# EAGLE design FSK (EAGLE 6.5.0)
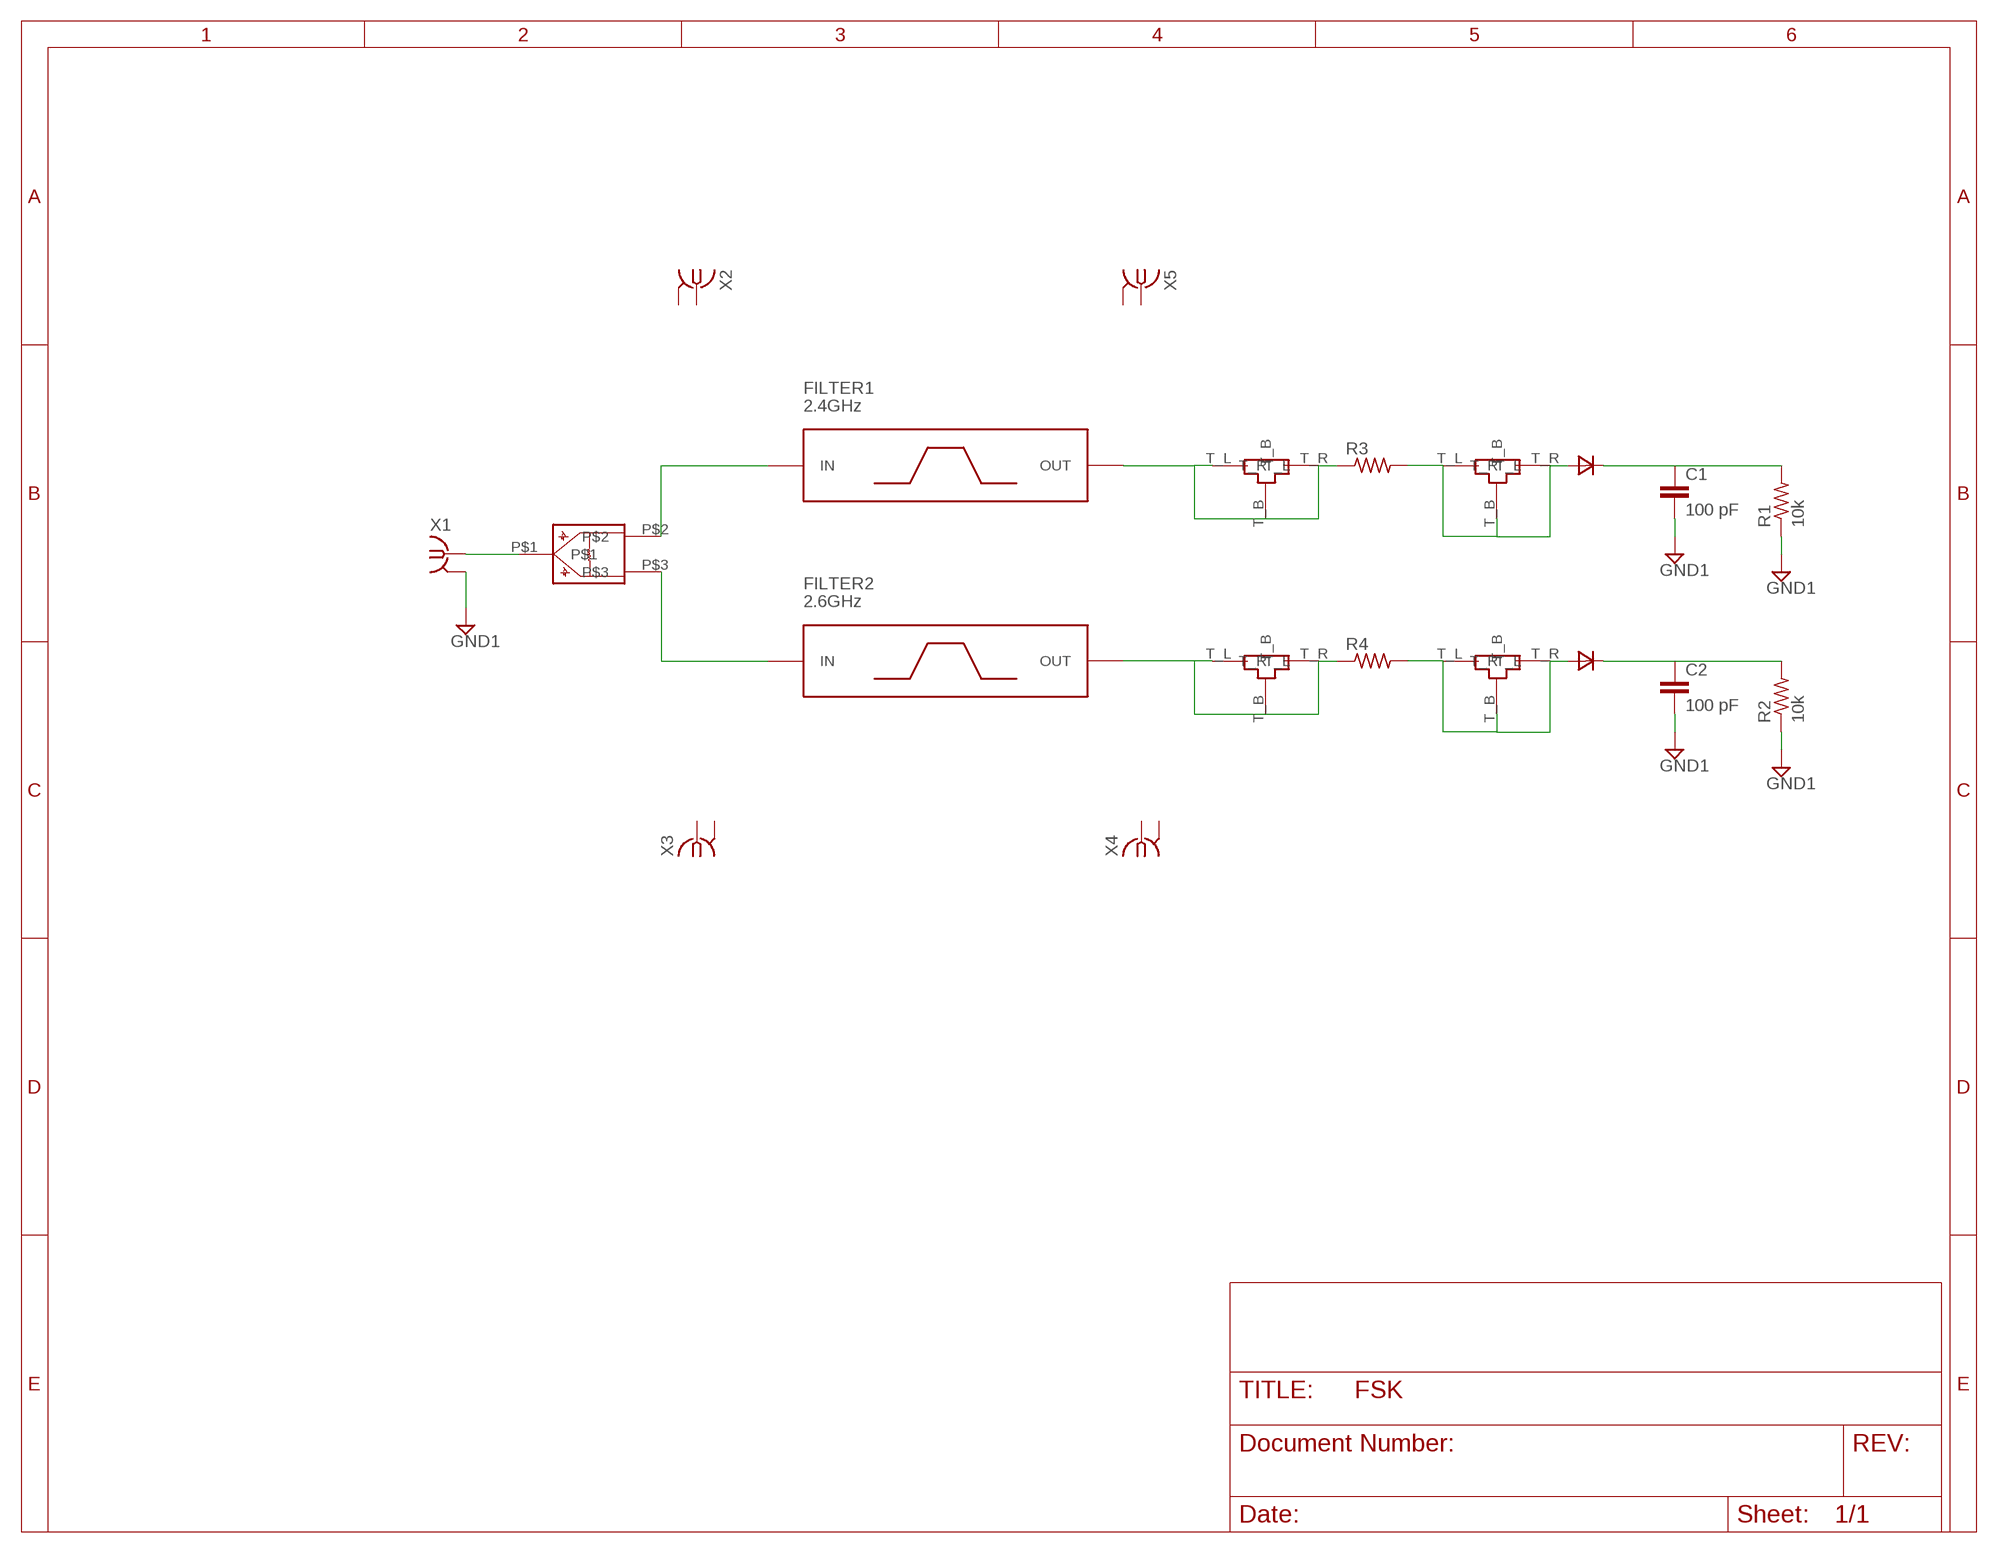
[diagram p0: schematic, sheet 1]

## Parts
2.4FIL  TEE_TL1  [TEE_TL1]
2.4TUNED  TEE_TL1  [TEE_TL1]
2.6FIL  TEE_TL1  [TEE_TL1]
2.6TUNED  TEE_TL1  [TEE_TL1]
C1  100 pF  C-EUC0603  [C0603]
C2  100 pF  C-EUC0603  [C0603]
FILTER1  2.4GHz  1IN_PIPE_CAP  [1IN_PIPE_CAP]
FILTER2  2.6GHz  1IN_PIPE_CAP  [1IN_PIPE_CAP]
R1  10k  R-US_M1206  [M1206]
R2  10k  R-US_M1206  [M1206]
R3  R-US_R0603  [R0603]
R4  R-US_R0603  [R0603]
U$1  WSPLITTER_2.5GHZ  [WSPLITTER_2.5GHZ]
U$2  HSMS-2850  [HSMS-2850]
U$3  HSMS-2850  [HSMS-2850]
X1  SMA-142-0711-821/826  [J502-ND-142-0711-821/826]
X2  SMA-142-0711-821/826  [J502-ND-142-0711-821/826]
X3  SMA-142-0711-821/826  [J502-ND-142-0711-821/826]
X4  SMA-142-0711-821/826  [J502-ND-142-0711-821/826]
X5  SMA-142-0711-821/826  [J502-ND-142-0711-821/826]

## Nets
2.4FIL: 2.4FIL.T_B 2.4FIL.T_L 2.4FIL.T_R FILTER1.OUT R3.1
2.4GHZ: FILTER1.IN U$1.P$2
2.4TUNED: 2.4TUNED.T_B 2.4TUNED.T_L 2.4TUNED.T_R R3.2 U$2.A
2.6FIL: 2.6FIL.T_B 2.6FIL.T_L 2.6FIL.T_R FILTER2.OUT R4.1
2.6GHZ: FILTER2.IN U$1.P$3
2.6TUNED: 2.6TUNED.T_B 2.6TUNED.T_L 2.6TUNED.T_R R4.2 U$3.A
GND1: C1.2 C2.2 R1.1 R2.1 X1.G@1 X1.G@2 X1.G@3 X1.G@4
N$3: C1.1 R1.2 U$2.C
N$4: C2.1 R2.2 U$3.C
N$5: U$1.P$1 X1.1
Unconnected: X2.1 X2.G@1 X2.G@2 X2.G@3 X2.G@4 X3.1 X3.G@1 X3.G@2 X3.G@3 X3.G@4 X4.1 X4.G@1 X4.G@2 X4.G@3 X4.G@4 X5.1 X5.G@1 X5.G@2 X5.G@3 X5.G@4

## Library data of the parts
2.4FIL 2.4TUNED 2.6FIL 2.6TUNED = ECE532_Parts:TEE_TL1
C1 C2 = rcl:C-EU: CAPACITOR, European symbol
FILTER1 FILTER2 = ECE532_Parts:1IN_PIPE_CAP
R1-R4 = rcl:R-US_: RESISTOR, American symbol
U$1 = ECE532_Parts:WSPLITTER_2.5GHZ
U$2 U$3 = ECE532_Parts:HSMS-2850
X1-X5 = con-coax:SMA-: SMA 50 Ohm End Launch Jack Receptacle - Round Contact Johnson Components Source: www.johnsoncomponents.com .. J502-ND.pdf; MF: JOHNSON COMPONENTS; MPN: 142-0711-821; OC_FARNELL: 1019328; OC_NEWARK: 16F3627

## Board
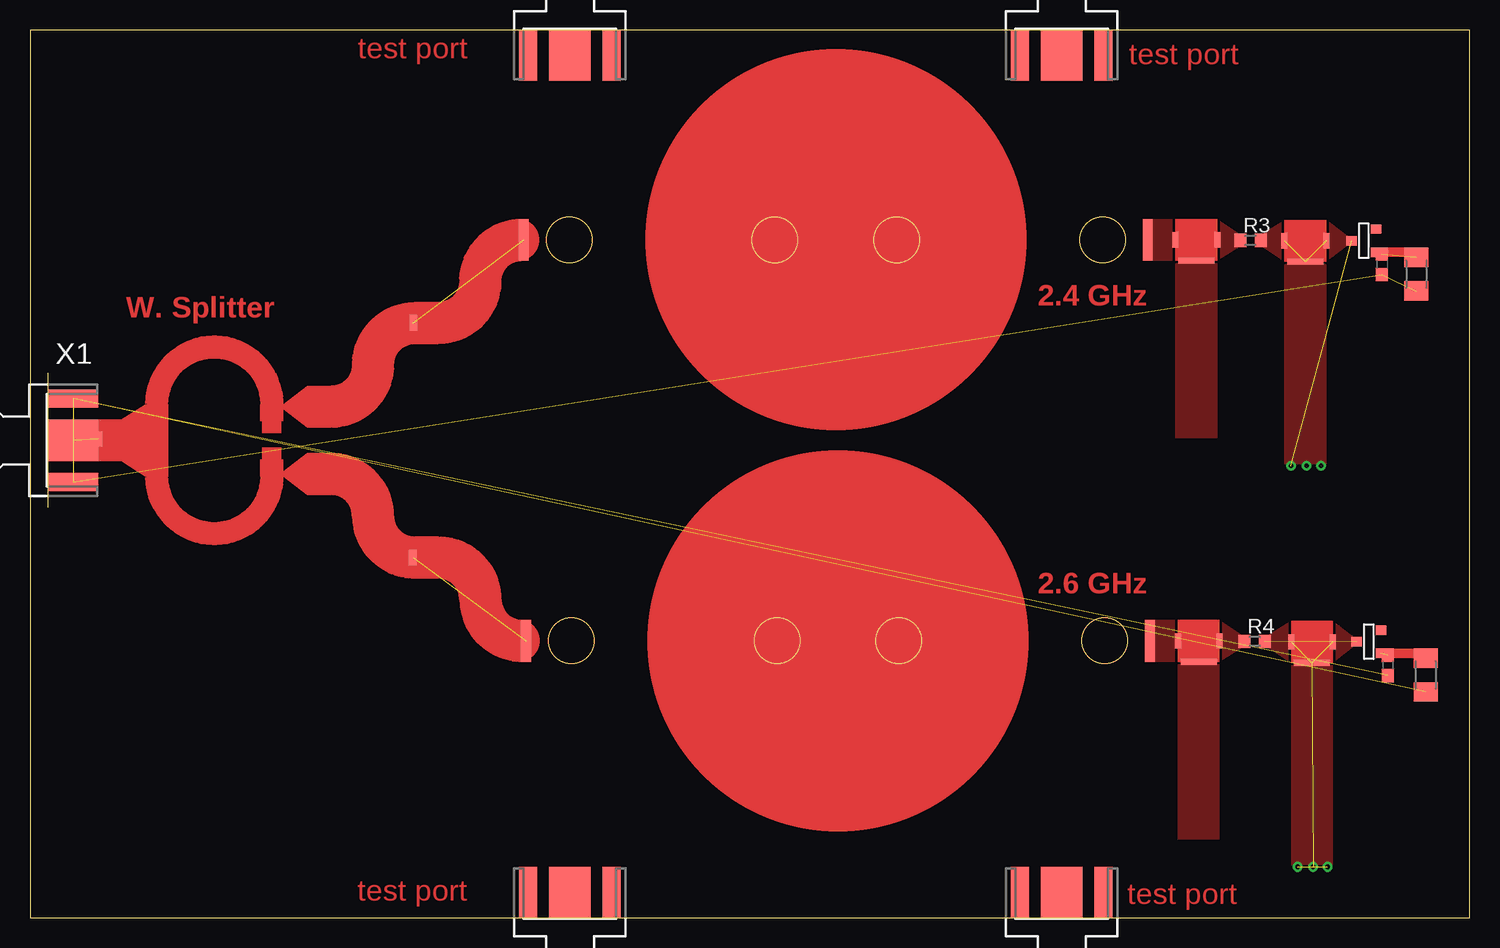
[diagram p1: board, top side]
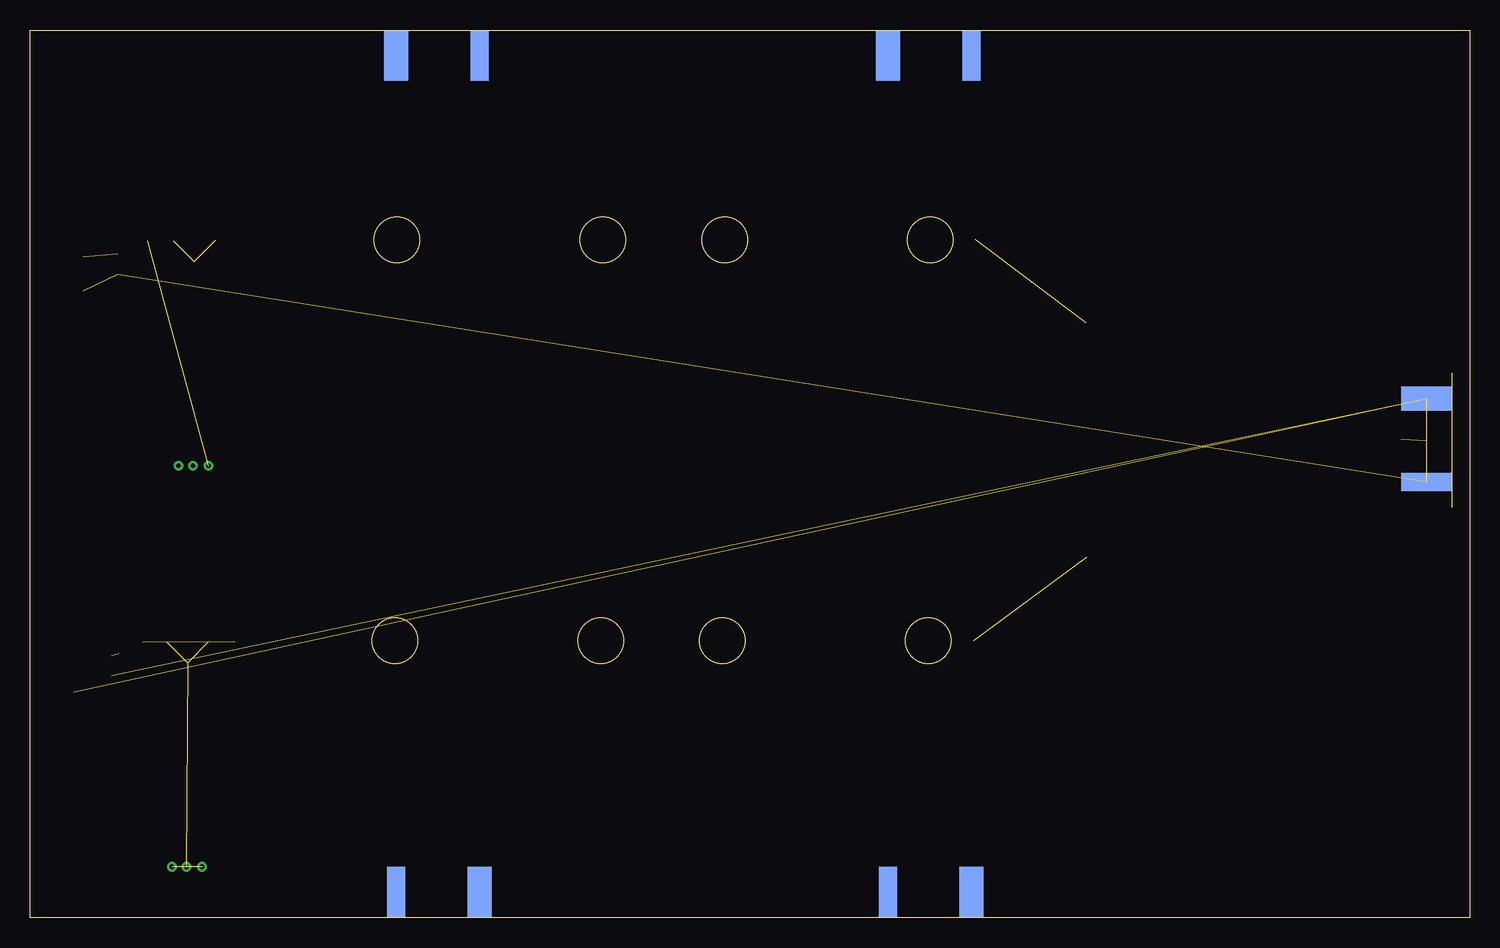
[diagram p2: board, bottom side, seen from below]

Size 120 x 74 mm. Coordinates in mm from the lower left corner, seen from the top.
Outline: 0,0 120,0 120,74 0,74 0,0
Copper layers (1*16): Top 0.035mm / dielectric 1.5mm / Bottom 0.035mm
Design rules "default": minimum track width 10mil, minimum drill 24mil, track to track 8mil, track to pad 8mil, pad to pad 8mil, via to via 8mil, smd to smd 8mil, copper to edge 40mil, drill to drill 8mil, minimum pad ring 10mil, minimum via ring 8mil, stop-mask expansion 4mil, vias tented up to drill 0mil, thermal gap 10mil

### Footprints (pad centres in the part's own frame; a part is rotated, then mirrored left to right if it is on the bottom)
TEE_TL1 = smd 3 x 0.5: T_B 0,-0.475 | smd 0.5 x 1.27: T_L -1.745,1.27; T_R 1.745,1.27
C0603 = smd 1.1 x 1: 1 -0.85,0; 2 0.85,0
1IN_PIPE_CAP = smd 0.8 x 3.49: IN -26,0; OUT 26,0
M1206 = smd 1.6 x 2: 1 -1.4,0; 2 1.4,0
R0603 = smd 1 x 1.1: 1 -0.85,0; 2 0.85,0
WSPLITTER_2.5GHZ = smd 0.635 x 1.27: P$1 -9.743,-0.194; P$2 16.528,9.479; P$3 16.499,-10.092
HSMS-2850 = smd 0.787 x 0.889: A 0.025,-1.016; C 0.991,1.016; NC -0.94,1.016
J502-ND-142-0711-821/826 = smd 4.191 x 3.49: 1 2.115,0 | smd 4.191 x 1.5: G@1 2.115,3.495; G@2 2.115,-3.495 | smd 4.191 x 2 bottom: G@3 2.115,3.495 | smd 4.191 x 1.5 bottom: G@4 2.115,-3.495

### Placement (x,y rotation side)
2.4FIL  97.23,55.23 0 top
2.4TUNED  106.33,55.15 0 top
2.6FIL  97.42,21.8 0 top
2.6TUNED  106.87,21.72 0 top
C1  112.69,54.45 270 top
C2  113.19,21.02 270 top
FILTER1  67.18,56.5 0 top
FILTER2  67.35,23.07 0 top
R1  115.56,53.65 90 top
R2  116.33,20.22 90 top
R3  101.74,56.46 0 top
R4  102.09,23.03 0 top
U$1  15.43,40.1 0 top
U$2  111.19,56.46 270 top
U$3  111.6,23.02 270 top
X1  1.48,39.79 0 top
X2  45,0 90 top
X3  45,74 270 top
X4  86,0 90 top
X5  86,74 270 top

### Tracks (layer width: path | path; a pad name or v marks a point on that pad's centre or on a via)
2.4FIL
  pour Top (no thermals): 95.48,54.76 98.97,54.76 98.97,39.96 95.48,39.96
  pour Top (no thermals): 93.5,58.25 95.5,58.25 95.5,54.76 93.5,54.76
  pour Top (no thermals): 98.97,54.76 98.97,58.25 100.97,56.9 100.97,56
2.4GHZ  (1 unrouted)
2.4TUNED  (via drill 0.4)  (3 unrouted)
  other vias: 105.12,37.66 106.42,37.66 107.62,37.66
  pour Top (no thermals): 104.58,58.16 104.58,54.67 102.58,56.02 102.58,56.92
  pour Top (no thermals): 108.06,54.68 108.06,58.17 110.06,56.63 110.06,56.23
  pour Top (no thermals): 104.58,37.81 104.58,54.68 108.07,54.68 108.07,37.81
2.6FIL
  pour Top (no thermals): 95.67,21.33 99.16,21.33 99.16,6.53 95.67,6.53
  pour Top (no thermals): 93.69,24.81 95.69,24.81 95.69,21.32 93.69,21.32
  pour Top (no thermals): 99.16,21.32 99.16,24.81 101.16,23.47 101.16,22.57
2.6GHZ  (1 unrouted)
2.6TUNED  (via drill 0.4)  (6 unrouted)
  other vias: 105.66,4.22 106.96,4.22 108.16,4.22
  pour Top (no thermals): 105.12,24.72 105.12,21.23 103.12,22.58 103.12,23.48
  pour Top (no thermals): 108.61,21.25 108.61,24.74 110.61,23.19 110.61,22.79
  pour Top (no thermals): 105.13,4.38 105.13,21.24 108.62,21.24 108.62,4.38
GND1  (7 unrouted)
N$3  (1 unrouted)
  Top 0.8: U$2.C 115.56,55.47 R1.2
N$4  (1 unrouted)
  Top 0.8: U$3.C 116.33,22.03 R2.2
N$5  (1 unrouted)
(copper drawn outside any net)
  Top 3.49: 34.05,49.57 arc90 37.54,53.06 arc-90 41.03,56.51 | 41.05,23.07 arc-90 37.55,26.52 arc90 34.06,30.01
  shapes: Top area x2

### Text on the board
Top: test port | test port | 2.4 GHz | W. Splitter | 2.6 GHz | test port | test port